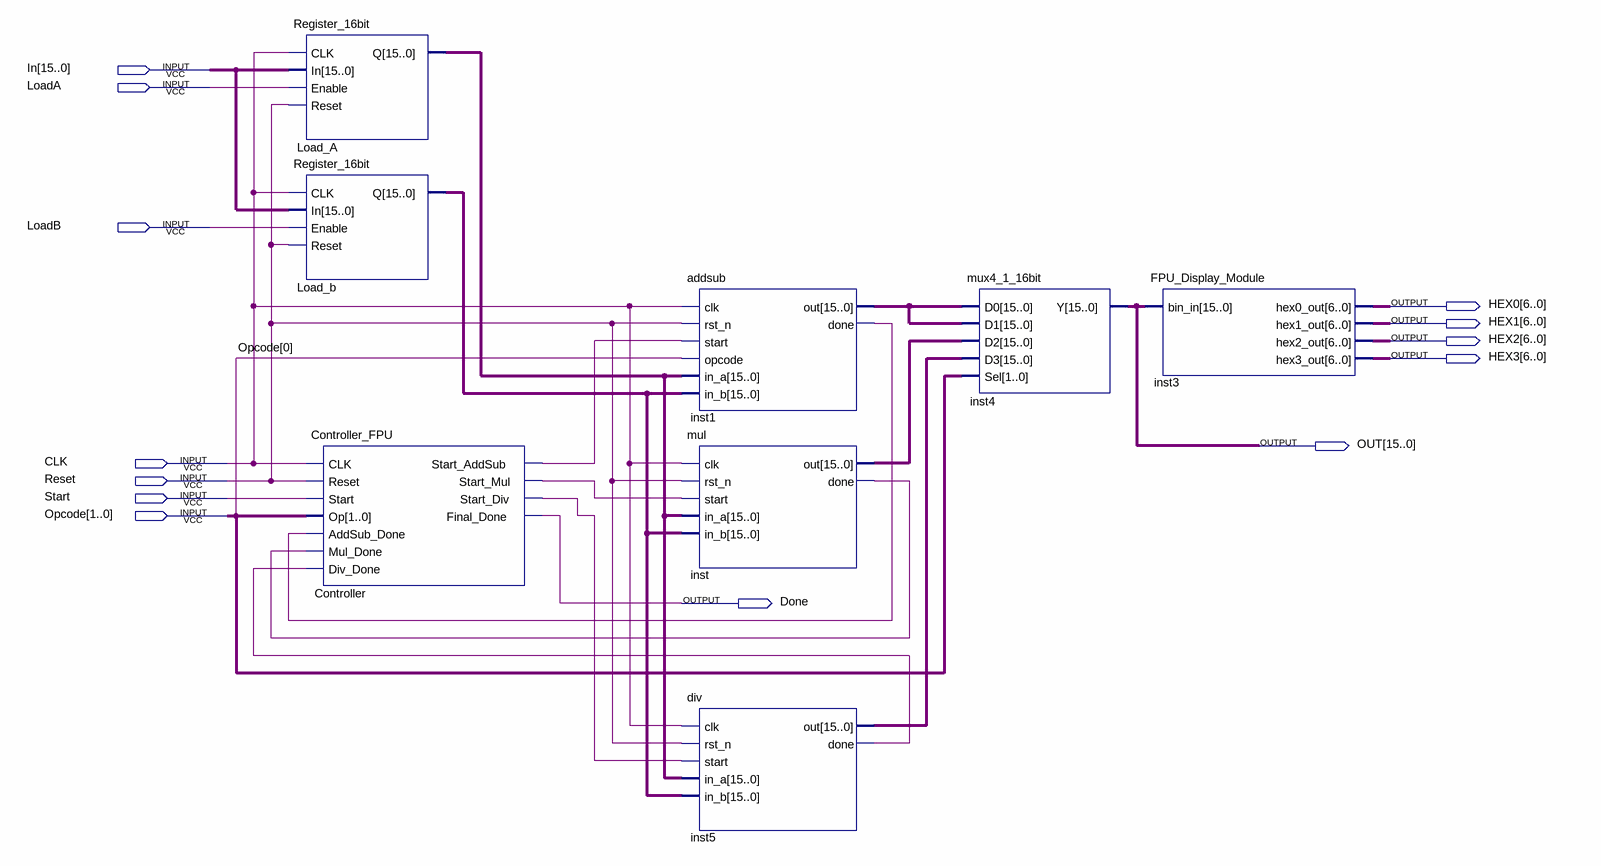
[diagram p0: schematic sheet]
// Quartus schematic FPU.bdf as structural Verilog: 8 symbols, 13 pins
module FPU (
  input  [15:0] In,
  input  LoadA,
  input  LoadB,
  input  CLK,
  input  Reset,
  input  Start,
  input  [1:0] Opcode,
  output [6:0] HEX0,
  output [6:0] HEX1,
  output [6:0] HEX2,
  output [6:0] HEX3,
  output [15:0] OUT,
  output Done
);

  wire Controller_start_addsub, Controller_start_div, Controller_start_mul, inst1_done, inst5_done, inst_done;
  wire [15:0] inst1_out, inst5_out, inst_out, Load_A_q, Load_b_q;

  Register_16bit Load_A (.CLK(CLK), .In(In), .Enable(LoadA), .Reset(Reset), .Q(Load_A_q));
  Register_16bit Load_b (.CLK(CLK), .In(In), .Enable(LoadB), .Reset(Reset), .Q(Load_b_q));
  Controller_FPU Controller (
    .CLK(CLK), .Reset(Reset), .Start(Start), .Op(Opcode), .AddSub_Done(inst1_done), .Mul_Done(inst_done),
    .Div_Done(inst5_done), .Start_AddSub(Controller_start_addsub), .Start_Mul(Controller_start_mul),
    .Start_Div(Controller_start_div), .Final_Done(Done));
  addsub inst1 (
    .clk(CLK), .rst_n(Reset), .start(Controller_start_addsub), .opcode(Opcode[0]), .in_a(Load_A_q),
    .in_b(Load_b_q), .out(inst1_out), .done(inst1_done));
  mul inst (
    .clk(CLK), .rst_n(Reset), .start(Controller_start_mul), .in_a(Load_A_q), .in_b(Load_b_q), .out(inst_out),
    .done(inst_done));
  div inst5 (
    .clk(CLK), .rst_n(Reset), .start(Controller_start_div), .in_a(Load_A_q), .in_b(Load_b_q),
    .out(inst5_out), .done(inst5_done));
  mux4_1_16bit inst4 (.D0(inst1_out), .D1(inst1_out), .D2(inst_out), .D3(inst5_out), .Sel(Opcode), .Y(OUT));
  FPU_Display_Module inst3 (.bin_in(OUT), .hex0_out(HEX0), .hex1_out(HEX1), .hex2_out(HEX2), .hex3_out(HEX3));
endmodule
